# Altium schematic sheet CAN_CTRL.SchDoc
size A4; SheetNumber: 7; SheetTotal: 15
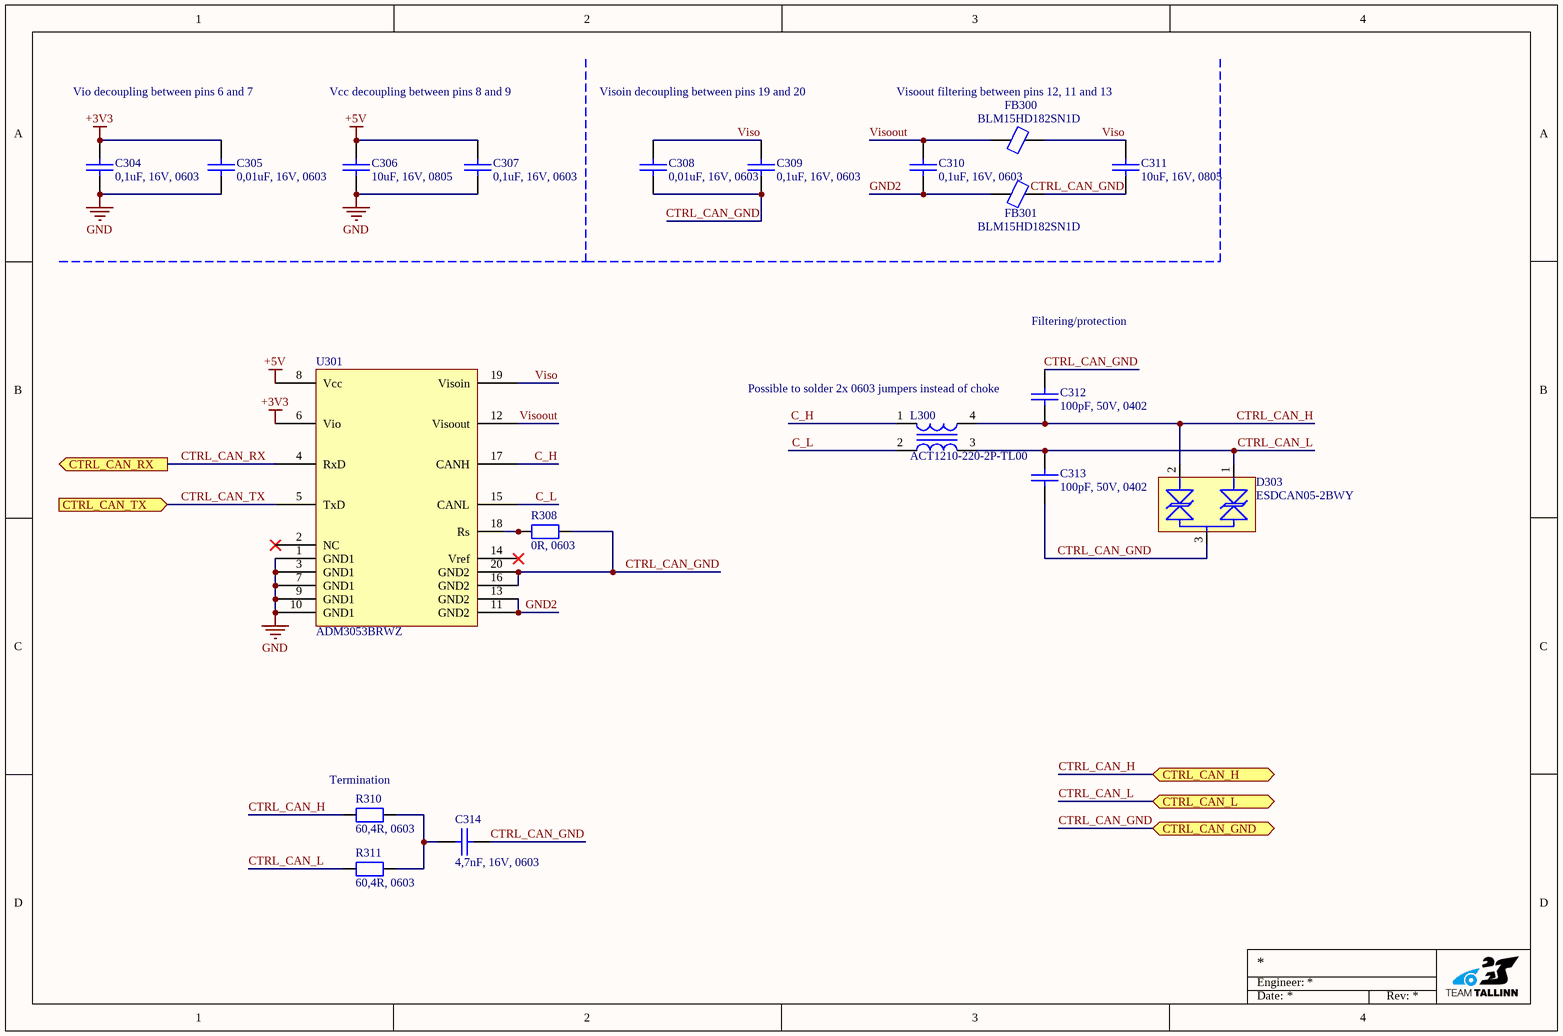
[diagram p0: CAN_CTRL.SchDoc]

## Parts
C304  0,1uF, 16V, 0603  [CAP [0603] 1608]
C305  0,01uF, 16V, 0603  [CAP [0603] 1608]
C306  10uF, 16V, 0805  [CAP [0805] 2012]
C307  0,1uF, 16V, 0603  [CAP [0603] 1608]
C308  0,01uF, 16V, 0603  [CAP [0603] 1608]
C309  0,1uF, 16V, 0603  [CAP [0603] 1608]
C310  0,1uF, 16V, 0603  [CAP [0603] 1608]
C311  10uF, 16V, 0805  [CAP [0805] 2012]
C312  100pF, 50V, 0402  [CAP [0402] 1005]
C313  100pF, 50V, 0402  [CAP [0402] 1005]
C314  4,7nF, 16V, 0603  [CAP [0603] 1608]
D303  ESDCAN05-2BWY  [SOT323/SC70-3]
FB300  BLM15HD182SN1D  [IND [0402] 1005]
FB301  BLM15HD182SN1D  [IND [0402] 1005]
L300  ACT1210-220-2P-TL00  [1210 Choke/ 2x0603 RES]
R308  0R, 0603  [RES [0603] 1608]
R310  60,4R, 0603  [RES [0603] 1608]
R311  60,4R, 0603  [RES [0603] 1608]
U301  ADM3053BRWZ  [SOIC-20]

## Ports
CTRL_CAN_GND (bidir), CTRL_CAN_H (bidir), CTRL_CAN_L (bidir), CTRL_CAN_RX (out), CTRL_CAN_TX (in)

## Nets
+3V3: C304.1 C305.1 U301.6(Vio)
+5V: C306.1 C307.1 U301.8(Vcc)
GND: C304.2 C305.2 C306.2 C307.2 U301.1(GND1) U301.3(GND1) U301.7(GND1) U301.9(GND1) U301.10(GND1)
C_H: L300.1 U301.17(CANH)
C_L: L300.2 U301.15(CANL)
CTRL_CAN_GND: C308.2 C309.2 C311.2 C312.2 C313.1 C314.2 D303.3 FB301.2 R308.1 U301.16(GND2) U301.20(GND2) ; port CTRL_CAN_GND
CTRL_CAN_H: C312.1 D303.2 L300.4 R310.2 ; port CTRL_CAN_H
CTRL_CAN_L: C313.2 D303.1 L300.3 R311.2 ; port CTRL_CAN_L
CTRL_CAN_RX: U301.4(RxD) ; port CTRL_CAN_RX
CTRL_CAN_TX: U301.5(TxD) ; port CTRL_CAN_TX
GND2: C310.2 FB301.1 U301.11(GND2) U301.13(GND2)
Viso: C308.1 C309.1 C311.1 FB300.2 U301.19(Visoin)
Visoout: C310.1 FB300.1 U301.12(Visoout)
NetC314_1: C314.1 R310.1 R311.1
NetR308_2: R308.2 U301.18(Rs)

Not connected (* = marked no-connect by the designer): U301 2(NC)* 14(Vref)*

## Notes on the sheet
- Vio decoupling between pins 6 and 7
- Vcc decoupling between pins 8 and 9
- Visoin decoupling between pins 19 and 20
- Visoout filtering between pins 12, 11 and 13
- Filtering/protection
- (near C312) Possible to solder 2x 0603 jumpers instead of choke
- (near R310) Termination
- Engineer:
- Date:
- Rev:

## Library data of the parts
C304-C314 = CMP-001-00084-16: Default capacitor part; Supplier Part Number: *; Supplier: *; Manufacturer Part Number: *
D303 = CMP-004-00048-1: Trans Voltage Suppressor Diode, 170W, 36V V(RWM), Bidirectional, 2 Element, Silicon; Manufacturer: STMicroelectronics; Manufacturer Part Number: ESDCAN05-2BWY; Datasheet: https://www.st.com/resource/en/datasheet/esdcan06-2bwy.pdf; Supplier: Digikey; Supplier Part Number: 497-17303-1-ND; Price: 0,36
FB300 FB301 = CMP-006-00015-1: Ferrite Chip, 1 Function(s), 0.2A, 2 Pin(s); Manufacturer: Murata; Supplier: Digikey; Manufacturer Part Number: BLM15HD182SN1D; Supplier Part Number: 490-5196-1-ND; Price: 0.15
L300 = CMP-006-00025-2: Data Line Filter, 2 Function(s), 80V, 0.25A, 4 Pin(s); Manufacturer: TDK; Manufacturer Part Number: ACT1210-220-2P-TL00; Price: 1,51; Supplier: Mouser; Supplier Part Number: 810-ACT12102202PTL00
R308 R310 R311 = CMP-009-00038-12: Standard resistor part; Supplier Part Number: *; Manufacturer Part Number: *; Supplier: *
U301 = CMP-015-00008-3: Interface Circuit, 1-Trnsvr, PDSO20; Manufacturer: Analog Devices; Price: 13,48; Manufacturer Part Number: ADM3053BRWZ; Supplier Part Number: 584-ADM3053BRWZ-R7; Datasheet: https://www.mouser.ee/datasheet/2/609/ADM3053-3120613.pdf; Supplier: Mouser